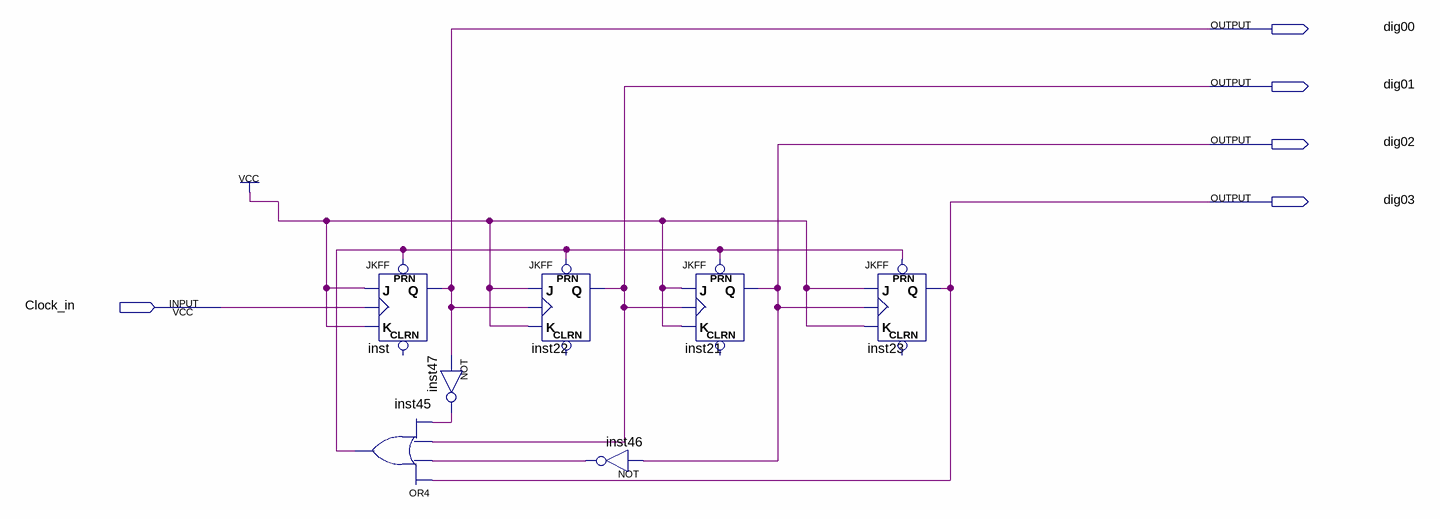
[diagram p0: schematic sheet]
// Quartus schematic contador_0_100.bdf as structural Verilog: 7 symbols, 5 pins
module contador_0_100 (
  input  Clock_in,
  output dig00,
  output dig01,
  output dig02,
  output dig03
);

  wire inst45_out, inst46_out, inst47_out;

  JKFF inst (.PRN(inst45_out), .K(1'b1), .J(1'b1), .CLK(Clock_in), .Q(dig00));  // open: CLRN
  or inst45 (inst45_out, dig03, inst46_out, dig01, inst47_out);
  not inst47 (inst47_out, dig00);
  JKFF inst22 (.PRN(inst45_out), .K(1'b1), .J(1'b1), .CLK(dig00), .Q(dig01));  // open: CLRN
  not inst46 (inst46_out, dig02);
  JKFF inst21 (.PRN(inst45_out), .K(1'b1), .J(1'b1), .CLK(dig01), .Q(dig02));  // open: CLRN
  JKFF inst23 (.PRN(inst45_out), .K(1'b1), .J(1'b1), .CLK(dig02), .Q(dig03));  // open: CLRN
endmodule
